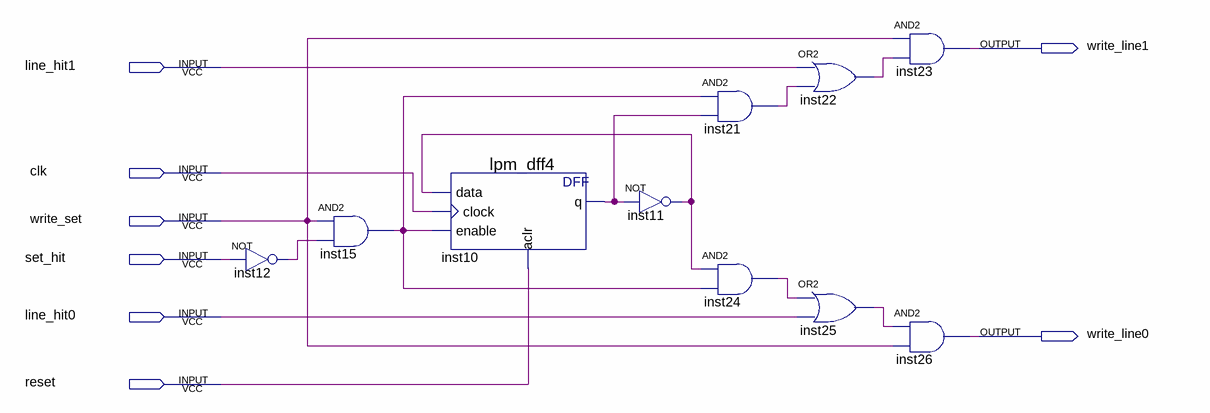
[diagram p0: schematic sheet]
// Quartus schematic cache_controller.bdf as structural Verilog: 10 symbols, 8 pins
module cache_controller (
  input  line_hit1,
  input  clk,
  input  write_set,
  input  set_hit,
  input  line_hit0,
  input  reset,
  output write_line1,
  output write_line0
);

  wire inst10_q, inst11_out, inst12_out, inst15_out, inst21_out, inst22_out, inst24_out, inst25_out;

  not inst12 (inst12_out, set_hit);
  and inst15 (inst15_out, write_set, inst12_out);
  lpm_dff4 inst10 (.data(inst11_out), .clock(clk), .enable(inst15_out), .aclr(reset), .q(inst10_q));
  not inst11 (inst11_out, inst10_q);
  and inst21 (inst21_out, inst15_out, inst10_q);
  and inst24 (inst24_out, inst11_out, inst15_out);
  or inst22 (inst22_out, line_hit1, inst21_out);
  or inst25 (inst25_out, inst24_out, line_hit0);
  and inst23 (write_line1, write_set, inst22_out);
  and inst26 (write_line0, inst25_out, write_set);
endmodule
